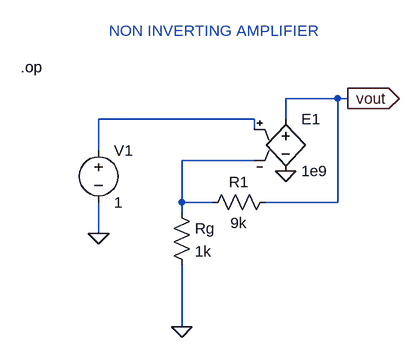
[diagram p0: schematic Non_Inverting_Amplifier.asc]
Non_Inverting_Amplifier.asc, the LTspice schematic file:
Version 4
SHEET 1 880 680
WIRE 384 80 304 80
WIRE 400 80 384 80
WIRE 256 112 16 112
WIRE 304 112 304 80
WIRE 256 128 256 112
WIRE 16 160 16 112
WIRE 256 176 144 176
WIRE 144 240 144 176
WIRE 192 240 144 240
WIRE 384 240 384 80
WIRE 384 240 272 240
WIRE 144 256 144 240
WIRE 16 288 16 240
WIRE 144 432 144 336
FLAG 304 192 0
FLAG 16 288 0
FLAG 400 80 vout
IOPIN 400 80 Out
FLAG 144 432 0
SYMBOL e 304 96 R0
SYMATTR InstName E1
SYMATTR Value 1e9
SYMBOL voltage 16 144 R0
SYMATTR InstName V1
SYMATTR Value 1
SYMBOL res 128 240 R0
SYMATTR InstName Rg
SYMATTR Value 1k
SYMBOL res 288 224 R90
WINDOW 0 0 56 VBottom 2
WINDOW 3 32 56 VTop 2
SYMATTR InstName R1
SYMATTR Value 9k
TEXT -104 32 Left 2 !.op
TEXT 32 -24 Left 2 ;NON INVERTING AMPLIFIER

The netlist it stands for:
* Non_Inverting_Amplifier.asc
E1 vout 0 N001 N002 1e9
V1 N001 0 1
Rg N002 0 1k
R1 vout N002 9k
.op
* NON INVERTING AMPLIFIER
.backanno
.end